# EAGLE schematic FitnessTracker (EAGLE 9.6.2)
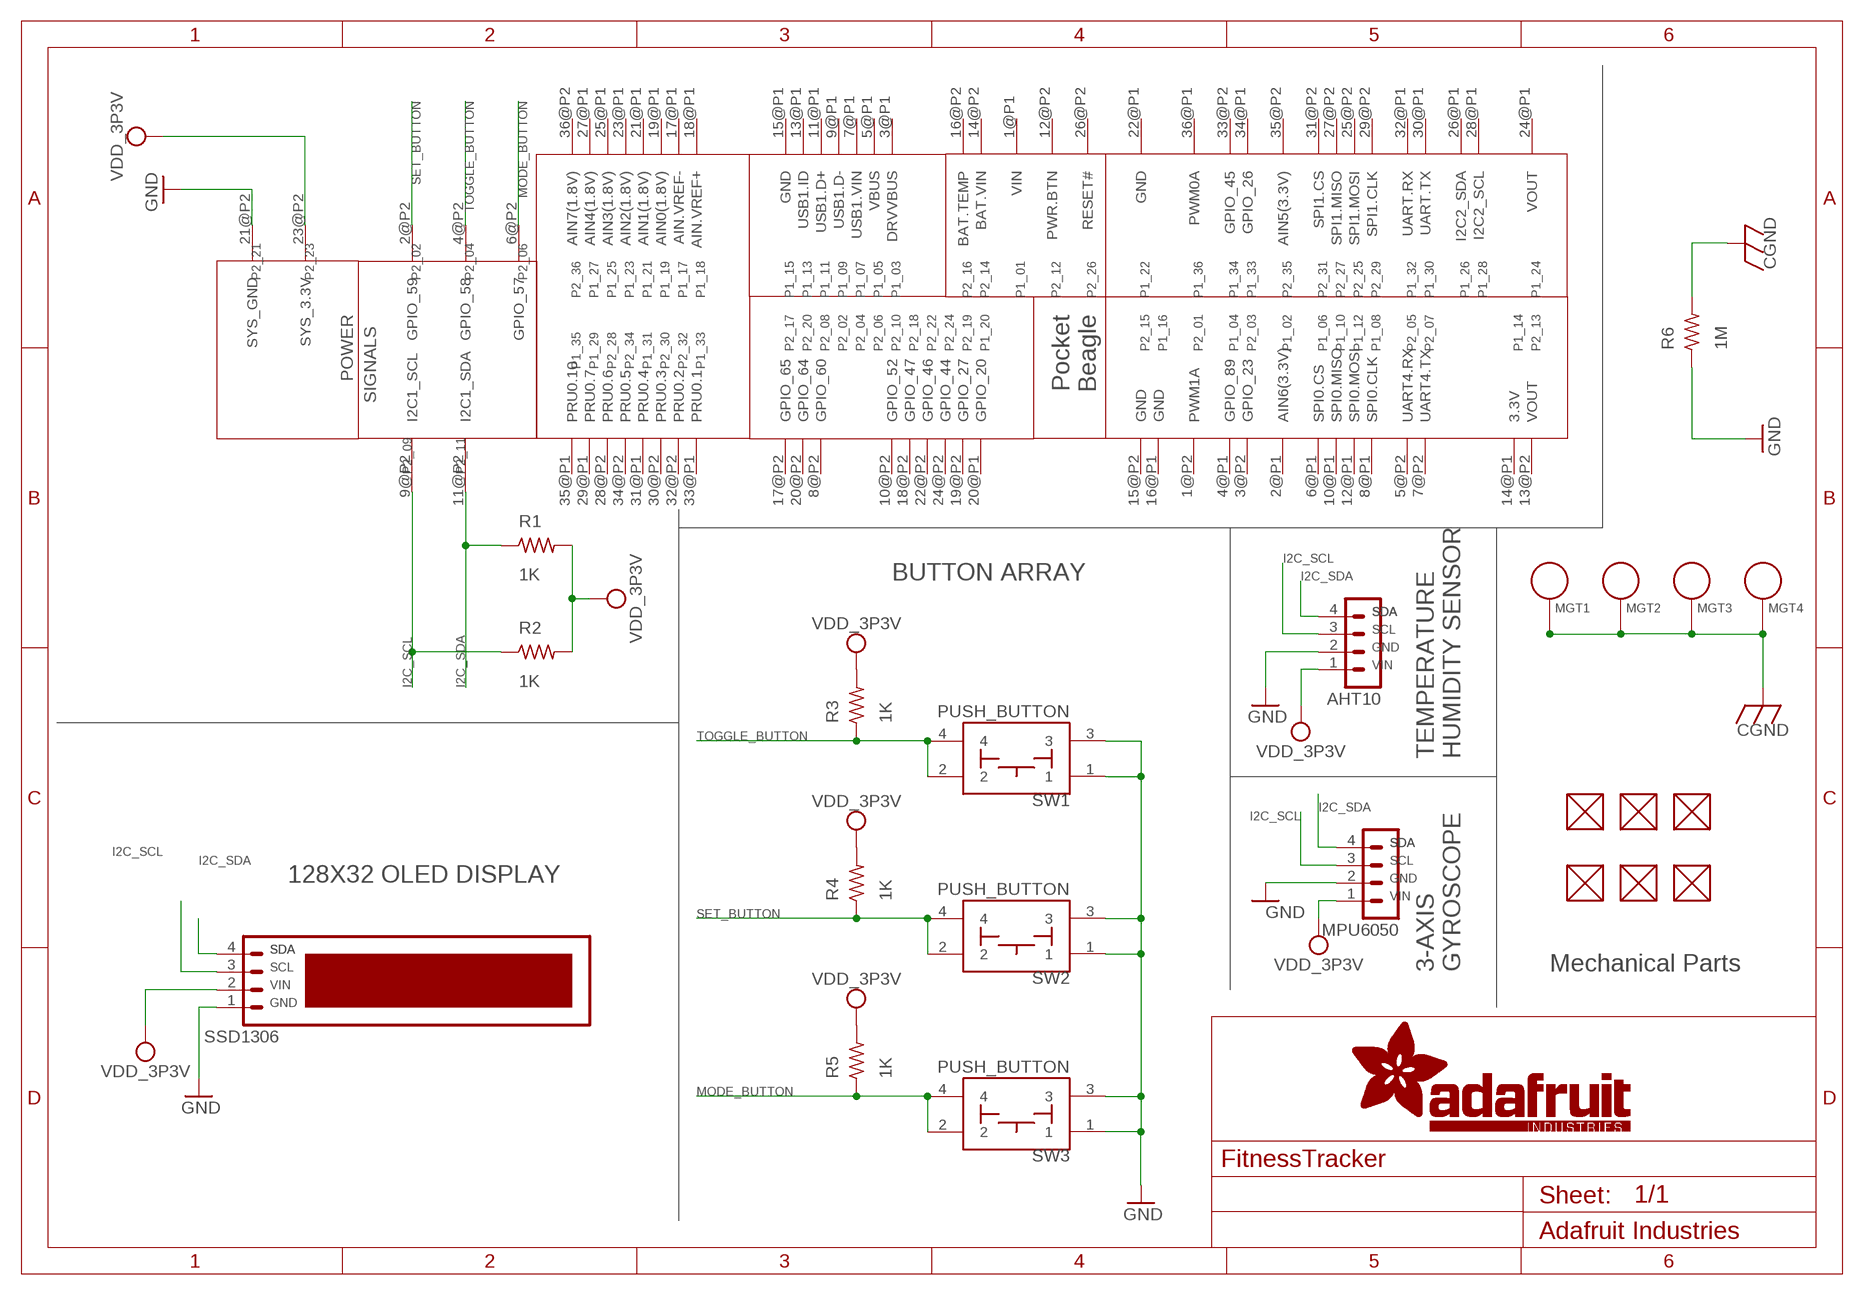
[diagram p0: schematic, sheet 1]

## Parts
FUD1  FIDUCIAL  [FIDUCIAL_40MIL]
FUD2  FIDUCIAL  [FIDUCIAL_40MIL]
FUD3  FIDUCIAL  [FIDUCIAL_40MIL]
FUD4  FIDUCIAL  [FIDUCIAL_40MIL]
FUD5  FIDUCIAL  [FIDUCIAL_40MIL]
FUD6  FIDUCIAL  [FIDUCIAL_40MIL]
MGT1  MOUNTING_HOLE  [MOUNTING_HOLE]
MGT2  MOUNTING_HOLE  [MOUNTING_HOLE]
MGT3  MOUNTING_HOLE  [MOUNTING_HOLE]
MGT4  MOUNTING_HOLE  [MOUNTING_HOLE]
R1  1K  R_R0603  [R0603]
R2  1K  R_R0603  [R0603]
R3  1K  R_R0603  [R0603]
R4  1K  R_R0603  [R0603]
R5  1K  R_R0603  [R0603]
R6  1M  R_R0603  [R0603]
SW1  PUSH_BUTTON  [BUTTON_12.5MM]
SW2  PUSH_BUTTON  [BUTTON_12.5MM]
SW3  PUSH_BUTTON  [BUTTON_12.5MM]
U$1  POCKETBEAGLE  [POCKETBEAGLE]
U$2  SSD1306  [MA04-1]
U$3  MPU6050  [MA04-1]
U$4  AHT10  [MA04-1]

## Nets
CGND: MGT1.P$1 MGT2.P$1 MGT3.P$1 MGT4.P$1 R6.2
GND: R6.1 SW1.1 SW1.3 SW2.1 SW2.3 SW3.1 SW3.3 U$1.21@P2(SYS_GND) U$2.1(GND) U$3.2(GND) U$4.2(GND)
I2C_SCL: R2.1 U$1.9@P2(I2C1_SCL) U$2.3(SCL) U$3.3(SCL) U$4.3(SCL)
I2C_SDA: R1.1 U$1.11@P2(I2C1_SDA) U$2.4(SDA) U$3.4(SDA) U$4.4(SDA)
MODE_BUTTON: R5.1 SW3.2 SW3.4 U$1.6@P2(GPIO_57)
SET_BUTTON: R4.1 SW2.2 SW2.4 U$1.2@P2(GPIO_59)
TOGGLE_BUTTON: R3.1 SW1.2 SW1.4 U$1.4@P2(GPIO_58)
VDD_3P3V: R1.2 R2.2 R3.2 R4.2 R5.2 U$1.23@P2(SYS_3.3V) U$2.2(VIN) U$3.1(VIN) U$4.1(VIN)
Unconnected: FUD1.P$1 FUD2.P$1 FUD3.P$1 FUD4.P$1 FUD5.P$1 FUD6.P$1 U$1.1@P1(VIN) U$1.1@P2(PWM1A) U$1.2@P1(AIN6(3.3V)) U$1.3@P1(DRVVBUS) U$1.3@P2(GPIO_23) U$1.4@P1(GPIO_89) U$1.5@P1(VBUS) U$1.5@P2(UART4.RX) U$1.6@P1(SPI0.CS) U$1.7@P1(USB1.VIN) U$1.7@P2(UART4.TX) U$1.8@P1(SPI0.CLK) U$1.8@P2(GPIO_60) U$1.9@P1(USB1.D-) U$1.10@P1(SPI0.MISO) U$1.10@P2(GPIO_52) U$1.11@P1(USB1.D+) U$1.12@P1(SPI0.MOSI) U$1.12@P2(PWR.BTN) U$1.13@P1(USB1.ID) U$1.13@P2(VOUT) U$1.14@P1(3.3V) U$1.14@P2(BAT.VIN) U$1.15@P1(GND) U$1.15@P2(GND) U$1.16@P1(GND) U$1.16@P2(BAT.TEMP) U$1.17@P1(AIN.VREF-) U$1.17@P2(GPIO_65) U$1.18@P1(AIN.VREF+) U$1.18@P2(GPIO_47) U$1.19@P1(AIN0(1.8V)) U$1.19@P2(GPIO_27) U$1.20@P1(GPIO_20) U$1.20@P2(GPIO_64) U$1.21@P1(AIN1(1.8V)) U$1.22@P1(GND) U$1.22@P2(GPIO_46) U$1.23@P1(AIN2(1.8V)) U$1.24@P1(VOUT) U$1.24@P2(GPIO_44) U$1.25@P1(AIN3(1.8V)) U$1.25@P2(SPI1.MOSI) U$1.26@P1(I2C2_SDA) U$1.26@P2(RESET#) U$1.27@P1(AIN4(1.8V)) U$1.27@P2(SPI1.MISO) U$1.28@P1(I2C2_SCL) U$1.28@P2(PRU0.6) U$1.29@P1(PRU0.7) U$1.29@P2(SPI1.CLK) U$1.30@P1(UART.TX) U$1.30@P2(PRU0.3) U$1.31@P1(PRU0.4) U$1.31@P2(SPI1.CS) U$1.32@P1(UART.RX) U$1.32@P2(PRU0.2) U$1.33@P1(PRU0.1) U$1.33@P2(GPIO_45) U$1.34@P1(GPIO_26) U$1.34@P2(PRU0.5) U$1.35@P1(PRU0.10) U$1.35@P2(AIN5(3.3V)) U$1.36@P1(PWM0A) U$1.36@P2(AIN7(1.8V))

## Notes on the sheet
- BUTTON ARRAY
- TEMPERATURE
  HUMIDITY SENSOR
- 128X32 OLED DISPLAY
- 3-AXIS 
  GYROSCOPE
- Mechanical Parts

## Library data of the parts
FUD1-FUD6 = MISC:FIDUCIAL
MGT1-MGT4 = MISC:MOUNTING_HOLE: Chassis Mounting Hole w/GND connection ability
R1-R6 = 301-lib:R_: RESISTOR, American symbol
SW1-SW3 = 301-lib:PUSH_BUTTON
U$1 = 301-lib:POCKETBEAGLE
U$2 = 301-lib:SSD1306
U$3 = 301-lib:MPU6050
U$4 = 301-lib:AHT10